# Altium schematic sheet Pin Connections.SchDoc
size A; SheetNumber: 3; SheetTotal: 3
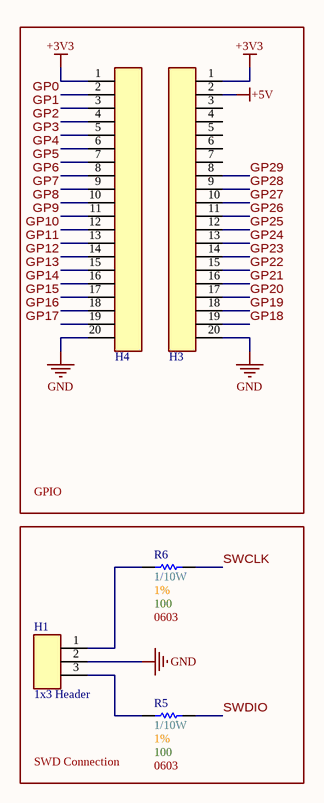
[diagram p0: Pin Connections.SchDoc]

## Parts
H1  1x3 Header  [[Header] 1x3 Male]
H3  1x20 Header  [[Header] 1x20 Male]  (value not drawn)
H4  1x20 Header  [[Header] 1x20 Male]  (value not drawn)
R5  Wattage: 1/10W  Tolerance: 1%  Resistance: 100  Size Package: 0603  [[Res] SMD 0603]  (hidden comment: [100] SMD 0603 1% 1/10W)
R6  Wattage: 1/10W  Tolerance: 1%  Resistance: 100  Size Package: 0603  [[Res] SMD 0603]  (hidden comment: [100] SMD 0603 1% 1/10W)

## Blocks framed on the sheet
GPIO: H3 H4
SWD Connection: H1 R5 R6

## Nets
+3V3: H3.1 H4.1
+5V: H3.2
GND: H1.2 H3.20 H4.20
GP0: H4.2
GP1: H4.3
GP2: H4.4
GP3: H4.5
GP4: H4.6
GP5: H4.7
GP6: H4.8
GP7: H4.9
GP8: H4.10
GP9: H4.11
GP10: H4.12
GP11: H4.13
GP12: H4.14
GP13: H4.15
GP14: H4.16
GP15: H4.17
GP16: H4.18
GP17: H4.19
GP18: H3.19
GP19: H3.18
GP20: H3.17
GP21: H3.16
GP22: H3.15
GP23: H3.14
GP24: H3.13
GP25: H3.12
GP26: H3.11
GP27: H3.10
GP28: H3.9
GP29: H3.8
SWCLK: R6.2
SWDIO: R5.2
NetH1_1: H1.1 R6.1
NetH1_3: H1.3 R5.1

Not connected (* = marked no-connect by the designer): H3 3 4 5 6 7

## Library data of the parts
H1 = [Header] 1x3 Male: 2.54mm pitch
H3 H4 = [Header] 1x20 Male: 2.54mm pitch
R5 R6 = [100] SMD 0603 1% 1/10W: RC0603FR-07100RL; Supplier 1: DigiKey; Supplier Part Number 1: 311-100HRDKR-ND